# Altium schematic sheet SUPERPID.SchDoc
size A4
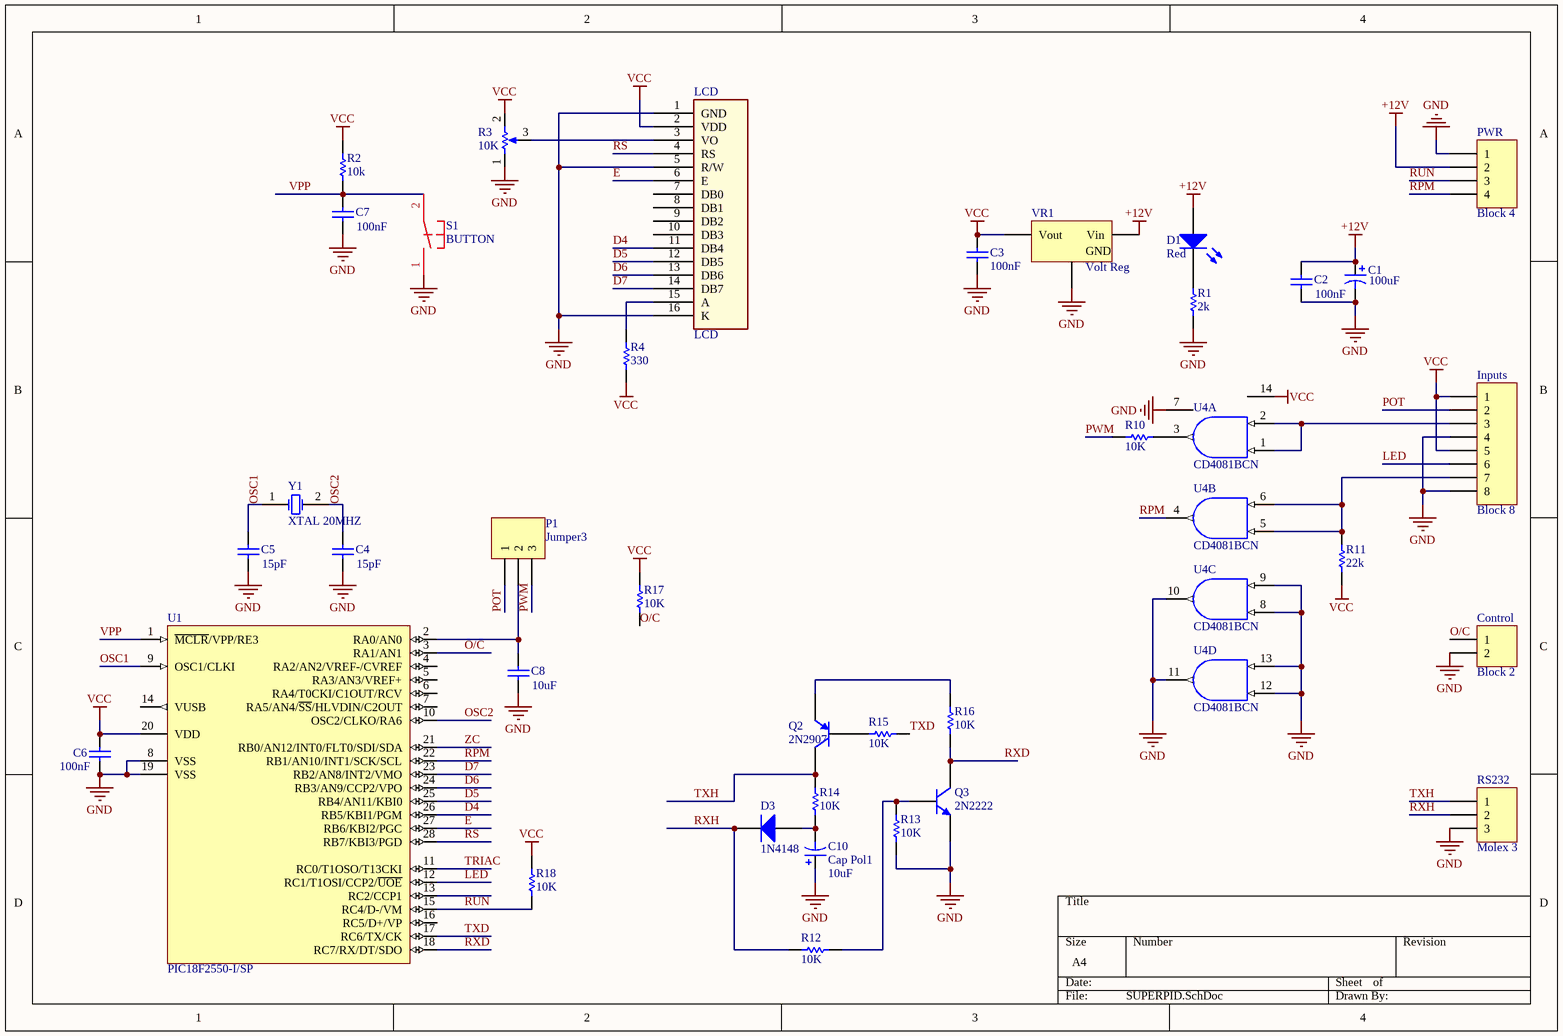
[diagram p0: SUPERPID.SchDoc]

## Parts
C1  100uF  [RADIAL CAPACITOR - 100uF - 10V]
C2  100nF  [6-0805_N]
C3  100nF  [6-0805_N]
C4  15pF  [6-0805_N]
C5  15pF  [6-0805_N]
C6  100nF  [6-0805_N]
C7  100nF  [6-0805_N]
C8  10uF  [CC3216-1206]
C10  Cap Pol1  value 10uF  [CONDENSADOR SMT]
Control  Block 2  [BOR-2]
D1  Red  [0805 LED RED]
D3  1N4148  [Diodo]
Inputs  Block 8  [BOR-8-5.08]
LCD  LCD  [LCD 16x2]
P1  Jumper3  [HDR1X3]
PWR  Block 4  [BOR-4-5.08]
Q2  2N2907  [SOT-23 - PNP]
Q3  2N2222  [SOT-23]
R1  2k  [6-0805_M]
R2  10k  [6-0805_M]
R3  10K  [TrimPot]
R4  value 330  [CR3216-1206]  (hidden comment: 330R)
R10  10K  [6-0805_N]
R11  22k  [CR3216-1206]
R12  10K  [CR3216-1206]
R13  10K  [CR3216-1206]
R14  10K  [CR3216-1206]
R15  10K  [CR3216-1206]
R16  10K  [CR3216-1206]
R17  10K  [CR3216-1206]
R18  10K  [CR3216-1206]
RS232  Molex 3  [BOR-3]
S1  BUTTON  [Switch - Omron]
U1  PIC18F2550-I/SP  [SPDIP300-SP28]
U4  CD4081BCN  [N14A]  (parts A,B,C,D of 4)
VR1  Volt Reg  [TO263-3-TD]
Y1  XTAL 20MHZ  [XTAL-2]

## Nets
+12V: C1.1 C2.1 D1.1(A) PWR.2 VR1.1(Vin)
GND: C1.2 C2.2 C3.1 C4.2 C5.2 C6.2 C7.2 C8.2 C10.1 Control.2 Inputs.4 Inputs.8 LCD.1(GND) LCD.5(R/W) LCD.16(K) PWR.1 Q3.E R1.1 R3.1(TOP) R13.2 RS232.3 S1.1 U1.8(VSS) U1.19(VSS) U4.7(GND) U4.8(A) U4.9(B) U4.10(J) U4.11(J) U4.12(A) U4.13(B) VR1.2(GND)
VCC: C3.2 C6.1 Inputs.1 Inputs.5 LCD.2(VDD) R2.2 R3.2(BOT) R4.2 R11.1 R17.2 R18.2 U1.20(VDD) U4.14(VDD) VR1.3(Vout)  [also labelled VDD]
D4: LCD.11(DB4) U1.26(RB5/KBI1/PGM)
D5: LCD.12(DB5) U1.25(RB4/AN11/KBI0)
D6: LCD.13(DB6) U1.24(RB3/AN9/CCP2/VPO)
D7: LCD.14(DB7) U1.23(RB2/AN8/INT2/VMO)
E: LCD.6(E) U1.27(RB6/KBI2/PGC)
LED: Inputs.6 U1.12(RC1/T1OSI/CCP2/~{UOE})
O/C: Control.1 R17.1 U1.3(RA1/AN1)
OSC1: C5.1 U1.9(OSC1/CLKI) Y1.1(OSC1)
OSC2: C4.1 U1.10(OSC2/CLKO/RA6) Y1.2(OSC2)
POT: Inputs.2 P1.1
PWM: P1.3 R10.2
RPM: PWR.4 U1.22(RB1/AN10/INT1/SCK/SCL) U4.4(J)
RS: LCD.4(RS) U1.28(RB7/KBI3/PGD)
RUN: PWR.3 R18.1 U1.15(RC4/D-/VM)
RXD: Q3.C R16.1 U1.18(RC7/RX/DT/SDO)
RXH: D3.2(K) R12.2 RS232.2
TRIAC: U1.11(RC0/T1OSO/T13CKI)
TXD: R15.2 U1.17(RC6/TX/CK)
TXH: Q2.C R14.1 RS232.1
VPP: C7.1 R2.1 S1.2 U1.1(~{MCLR}/VPP/RE3)
ZC: U1.21(RB0/AN12/INT0/FLT0/SDI/SDA)
NetC8_1: C8.1 P1.2 U1.2(RA0/AN0)
NetC10_2: C10.2 D3.1(A) R14.2
NetD1_2: D1.2(K) R1.2
NetInputs_3: Inputs.3 U4.1(A) U4.2(B)
NetInputs_7: Inputs.7 R11.2 U4.5(A) U4.6(B)
NetLCD_3: LCD.3(VO) R3.3(TAP)
NetLCD_15: LCD.15(A) R4.1
NetQ2_B: Q2.B R15.1
NetQ2_E: Q2.E R16.2
NetQ3_B: Q3.B R12.1 R13.1
NetR10_1: R10.1 U4.3(J)

Not connected (* = marked no-connect by the designer): LCD 7(DB0) 8(DB1) 9(DB2) 10(DB3); U1 4(RA2/AN2/VREF-/CVREF) 5(RA3/AN3/VREF+) 6(RA4/T0CKI/C1OUT/RCV) 7(RA5/AN4/~{SS}/HLVDIN/C2OUT) 13(RC2/CCP1) 14(VUSB) 16(RC5/D+/VP)

## Library data of the parts
C1 C10 = Cap Pol1: Polarized Capacitor (Radial); PackageReference: RB7.6-15
  C1: Published: 8-Jun-2000; LatestRevisionDate: 17-Jul-2002; LatestRevisionNote: Re-released for DXP Platform.; Publisher: Altium Limited; PackageDescription: Polarized Capacitor (Radial); 2 Leads; Value: 100uF
C2-C8 = Cap Semi: Capacitor 0805; Published: 8-Jun-2000; LatestRevisionDate: 29-May-2009; LatestRevisionNote: IPC-7351 Footprint Added.; PackageReference: C1206; Publisher: Altium Limited; PackageDescription: Chip Capacitor
  C2 C3 C6 C7: Value: 100nF
  C4 C5: Value: 15pF
  C8: Value: 10uF
Control = Header 2: Header, 2-Pin; LatestRevisionDate: 17-Jul-2002; LatestRevisionNote: Re-released for DXP Platform.; Publisher: Altium Limited
D1 = LED3: Typical BLUE SiC LED; Published: 8-Jun-2000; LatestRevisionDate: 17-Dec-2003; LatestRevisionNote: PCB Footprint replaced.; DatasheetDocument: 16-Apr-2002; PackageDocument: 16-Apr-2002; PackageReference: 3.5X2.8X1.9; Publisher: Altium Limited
D3 = Diode 1N4007: 1 Amp General Purpose Rectifier; Published: 8-Jun-2000; LatestRevisionDate: 17-Jul-2002; LatestRevisionNote: Re-released for DXP Platform.; DatasheetVersion: 1998; PackageVersion: Aug-1999; PackageReference: DO-41; Publisher: Altium Limited; PackageDescription: Diode, Axial; Body 5.2 x 2.7 mm (LxDia. max), Lead Dia. 0.86 mm (max); Code_JEDEC: DO-204-AL; ComponentLink1Description: Manufacturer Link; ComponentLink1URL: http://www.fairchildsemi.com/; ComponentLink2Description: Datasheet; ComponentLink2URL: http://www.fairchildsemi.com/ds/1N%2F1N4001.pdf
Inputs = Header 8: Header, 8-Pin; LatestRevisionDate: 17-Jul-2002; LatestRevisionNote: Re-released for DXP Platform.; Publisher: Altium Limited
LCD = LCD 16*2: HD44780 parallel interface chipset
P1 RS232 = Header 3: Header, 3-Pin; LatestRevisionDate: 17-Jul-2002; LatestRevisionNote: Re-released for DXP Platform.; Publisher: Altium Limited
PWR = Header 4: Header, 4-Pin; LatestRevisionDate: 17-Jul-2002; LatestRevisionNote: Re-released for DXP Platform.; Publisher: Altium Limited
Q2 = PNP: PNP Bipolar Transistor; Published: 8-Jun-2000; LatestRevisionDate: 29-May-2009; LatestRevisionNote: IPC-7351 Footprint Added.; PackageVersion: Aug-1999; PackageReference: SOT-23B; Publisher: Altium Limited; PackageDescription: 3-Pin SOT-23 Package 0.95 mm Pitch, 2.4 mm Lead Span
Q3 = NPN: NPN Bipolar Transistor; Published: 8-Jun-2000; LatestRevisionDate: 17-Jul-2002; LatestRevisionNote: Re-released for DXP Platform.; PackageReference: TO-226-AA; Publisher: Altium Limited; PackageDescription: TO, Flat Index; 3 In-Line, Axial Leads; Body Dia. 4.8mm; Leads 0.55 x 0.51 mm (max); Code_JEDEC: TO-226-AA
R1 R2 R4 = Res1: Chip Resistor 1206; Published: 8-Jun-2000; LatestRevisionDate: 17-Jul-2002; LatestRevisionNote: Re-released for DXP Platform.; PackageReference: AXIAL-0.3; Publisher: Altium Limited
  R1: Value: 2k
  R2: Value: 10k
R3 = RPot: Potentiometer; Sim Note: Enter the Resistance value and the set point into parameter fields.; Set Position: 0.5; Published: 8-Jun-2000; LatestRevisionDate: 17-Jul-2002; LatestRevisionNote: Re-released for DXP Platform.; PackageReference: VR5; Publisher: Altium Limited; PackageDescription: Variable Resistor, Thru-Hole; 3 Leads; Value: 10K
R10-R18 = Res1: Resistor; PackageReference: AXIAL-0.3
  R10 R12-R18: Value: 10K
  R11: Value: 22k
U1 = PIC18F2550-I/SP: High Performance, Enhanced Flash, USB Microcontroller with nanoWatt Technology, 32K Flash, 28-Pin SPDIP, Industrial Temperature Range; Published: 29-Jan-2009; LatestRevisionDate: 02-Dec-2009; LatestRevisionNote: Updated to datasheet revision E, Aug-2008; DatasheetVersion: revE, Aug-2008; PackageVersion: revBB, Aug-2009; PackageReference: SPDIP300-SP28; Publisher: Altium Limited; PackageDescription: 28-Lead Skinny Plastic Dual In-Line (SP) - 300 mil Body [SPDIP]; Supplier 1: Digi-Key; Supplier Part Number 1: PIC18F2550-I/SP-ND; Supplier 2: Farnell; Supplier Part Number 2: 9321250; Supplier 3: Farnell; Supplier Part Number 3: 1523822; ComponentLink1Description: Datasheet; ComponentLink1URL: http://ww1.microchip.com/downloads/en/DeviceDoc/39632e.pdf; ComponentLink2Description: Packaging Specification; ComponentLink2URL: http://www.microchip.com/stellent/groups/techpub_sg/documents/packagingspec/en012702.pdf; ComponentLink3Description: Microchip.com Home; ComponentLink3URL: http://www.microchip.com/
U4 = CD4081BCN: Quad 2-Input AND Buffered B series Gate, 14-Pin PDIP; IC_Technology: C; Published: 17-Jul-2002; LatestRevisionDate: 29-May-2009; LatestRevisionNote: Component Body Added.; DatasheetVersion: Jan-1999; PackageVersion: 2000; PackageReference: N14A; Publisher: Altium Limited; PackageDescription: DIP, 14-Pin, Row Spacing 7.62 mm, Pitch 2.54 mm; ComponentLink1Description: Manufacturer Link; ComponentLink1URL: http://www.fairchildsemi.com/; ComponentLink2Description: Datasheet; ComponentLink2URL: http://www.fairchildsemi.com/ds/CD%2FCD4071BC.pdf
VR1 = Volt Reg: Voltage Regulator; Published: 24-Mar-1999; LatestRevisionDate: 29-May-2009; LatestRevisionNote: IPC-7351 Footprint Added.; PackageReference: D2PAK; Publisher: Altium Limited; PackageDescription: 3-Pin Transistor Outline Package 2.54 mm Pitch, 15.1 mm Lead Span
Y1 = XTAL: Crystal Oscillator; Published: 8-Jun-2000; LatestRevisionDate: 17-Jul-2002; LatestRevisionNote: Re-released for DXP Platform.; PackageReference: R38; Publisher: Altium Limited; PackageDescription: Crystal, Thru-Hole; 2 Leads; Body 3.1 x 8.2 mm (Dia.xH)